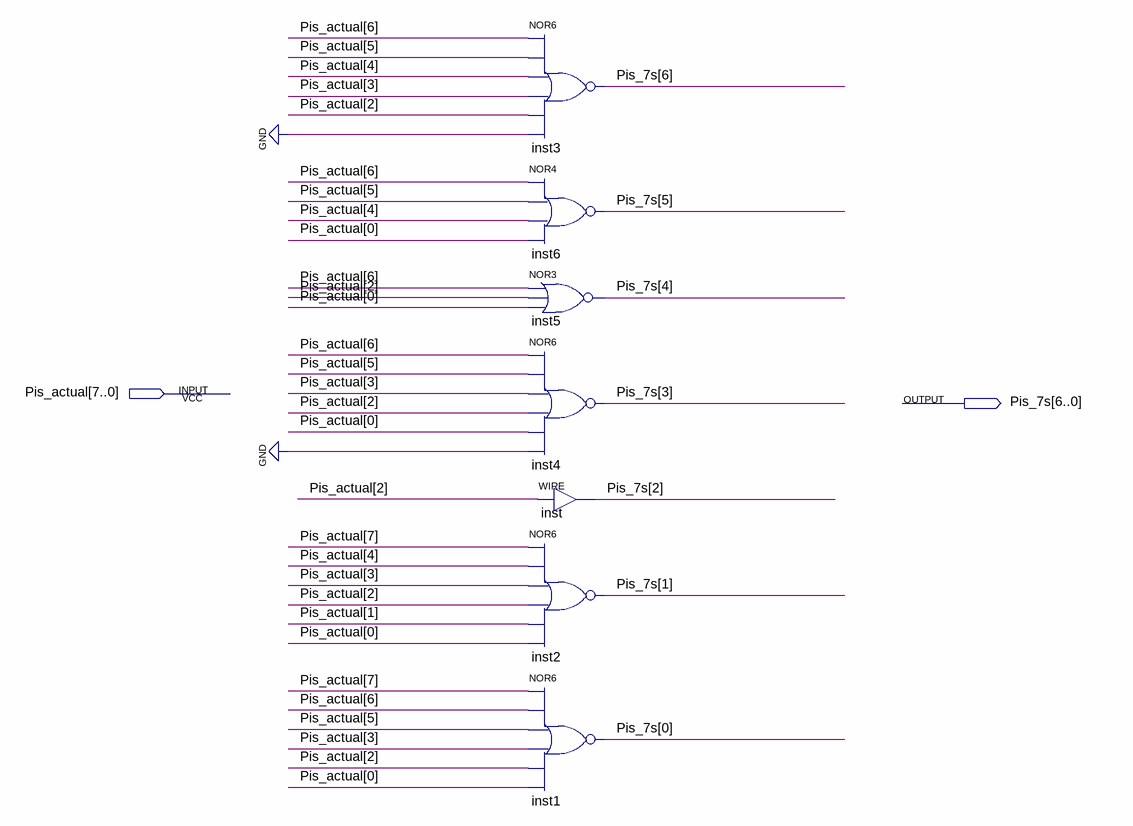
[diagram p0: schematic sheet]
// Quartus schematic Display.bdf as structural Verilog: 7 symbols, 2 pins
module Display (
  input  [7:0] Pis_actual,
  output [6:0] Pis_7s
);

  nor inst3 (Pis_7s[6], Pis_actual[6], Pis_actual[5], Pis_actual[4], Pis_actual[3], Pis_actual[2], 1'b0);
  nor inst6 (Pis_7s[5], Pis_actual[6], Pis_actual[5], Pis_actual[4], Pis_actual[0]);
  nor inst5 (Pis_7s[4], Pis_actual[6], Pis_actual[2], Pis_actual[0]);
  nor inst4 (Pis_7s[3], Pis_actual[6], Pis_actual[5], Pis_actual[3], Pis_actual[2], Pis_actual[0], 1'b0);
  nor inst2 (Pis_7s[1], Pis_actual[7], Pis_actual[4], Pis_actual[3], Pis_actual[2], Pis_actual[1], Pis_actual[0]);
  nor inst1 (Pis_7s[0], Pis_actual[7], Pis_actual[6], Pis_actual[5], Pis_actual[3], Pis_actual[2], Pis_actual[0]);
  assign Pis_7s[2] = Pis_actual[2];  // WIRE inst
endmodule
